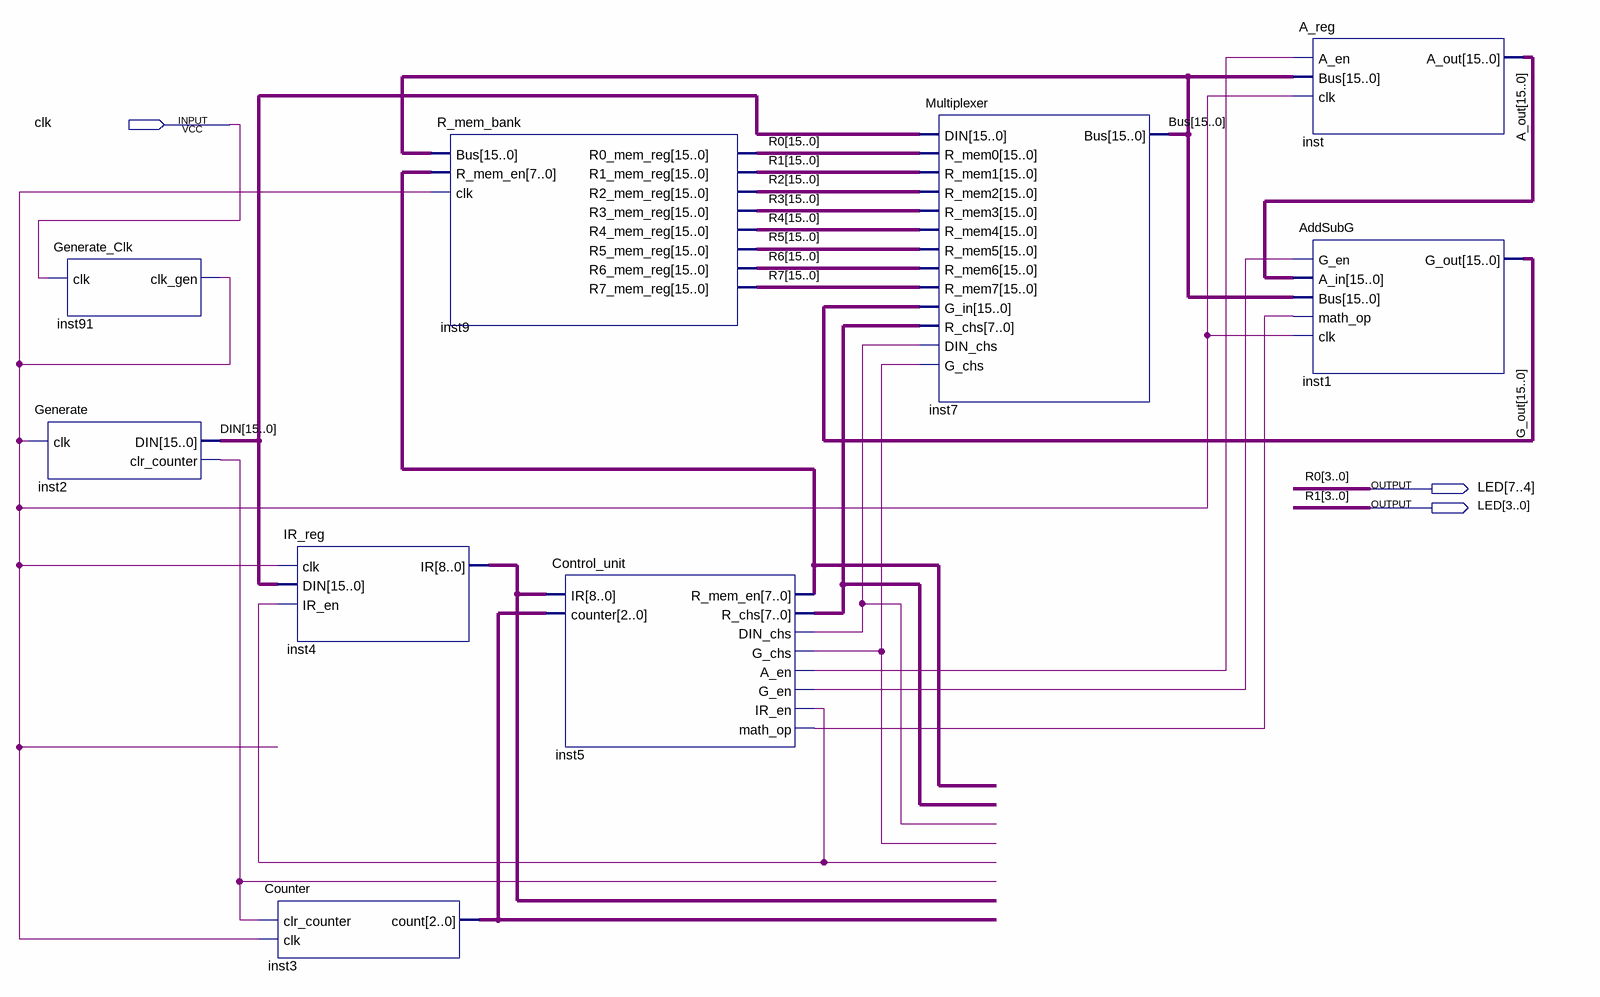
[diagram p0: schematic sheet]
// Quartus schematic Lab8.bdf as structural Verilog: 9 symbols, 3 pins
module Lab8 (
  input  clk,
  output [7:0] LED
);

  wire inst2_clr_counter, inst5_a_en, inst5_din_chs, inst5_g_chs, inst5_g_en, inst5_ir_en, inst5_math_op,
       inst91_clk_gen;
  wire [2:0] inst3_count;
  wire [7:0] inst5_r_chs, inst5_r_mem_en;
  wire [8:0] inst4_ir;
  wire [15:0] A_out, Bus, DIN, G_out, R2, R3, R4, R5, R6, R7;
  wire [15:4] R0, R1;

  Generate inst2 (.clk(inst91_clk_gen), .DIN(DIN), .clr_counter(inst2_clr_counter));
  Generate_Clk inst91 (.clk(clk), .clk_gen(inst91_clk_gen));
  Counter inst3 (.clr_counter(inst2_clr_counter), .clk(inst91_clk_gen), .count(inst3_count));
  IR_reg inst4 (.clk(inst91_clk_gen), .DIN(DIN), .IR_en(inst5_ir_en), .IR(inst4_ir));
  R_mem_bank inst9 (
    .Bus(Bus), .R_mem_en(inst5_r_mem_en), .clk(inst91_clk_gen), .R0_mem_reg({R0, LED[7:4]}),
    .R1_mem_reg({R1, LED[3:0]}), .R2_mem_reg(R2), .R3_mem_reg(R3), .R4_mem_reg(R4), .R5_mem_reg(R5),
    .R6_mem_reg(R6), .R7_mem_reg(R7));
  Control_unit inst5 (
    .IR(inst4_ir), .counter(inst3_count), .R_mem_en(inst5_r_mem_en), .R_chs(inst5_r_chs),
    .DIN_chs(inst5_din_chs), .G_chs(inst5_g_chs), .A_en(inst5_a_en), .G_en(inst5_g_en), .IR_en(inst5_ir_en),
    .math_op(inst5_math_op));
  Multiplexer inst7 (
    .DIN(DIN), .R_mem0({R0, LED[7:4]}), .R_mem1({R1, LED[3:0]}), .R_mem2(R2), .R_mem3(R3), .R_mem4(R4),
    .R_mem5(R5), .R_mem6(R6), .R_mem7(R7), .G_in(G_out), .R_chs(inst5_r_chs), .DIN_chs(inst5_din_chs),
    .G_chs(inst5_g_chs), .Bus(Bus));
  A_reg inst (.A_en(inst5_a_en), .Bus(Bus), .clk(inst91_clk_gen), .A_out(A_out));
  AddSubG inst1 (
    .G_en(inst5_g_en), .A_in(A_out), .Bus(Bus), .math_op(inst5_math_op), .clk(inst91_clk_gen), .G_out(G_out));

  // Other names for the same wires on the sheet: R0[3:0] = LED[7:4]; R1[3:0] = LED[3:0]
endmodule
